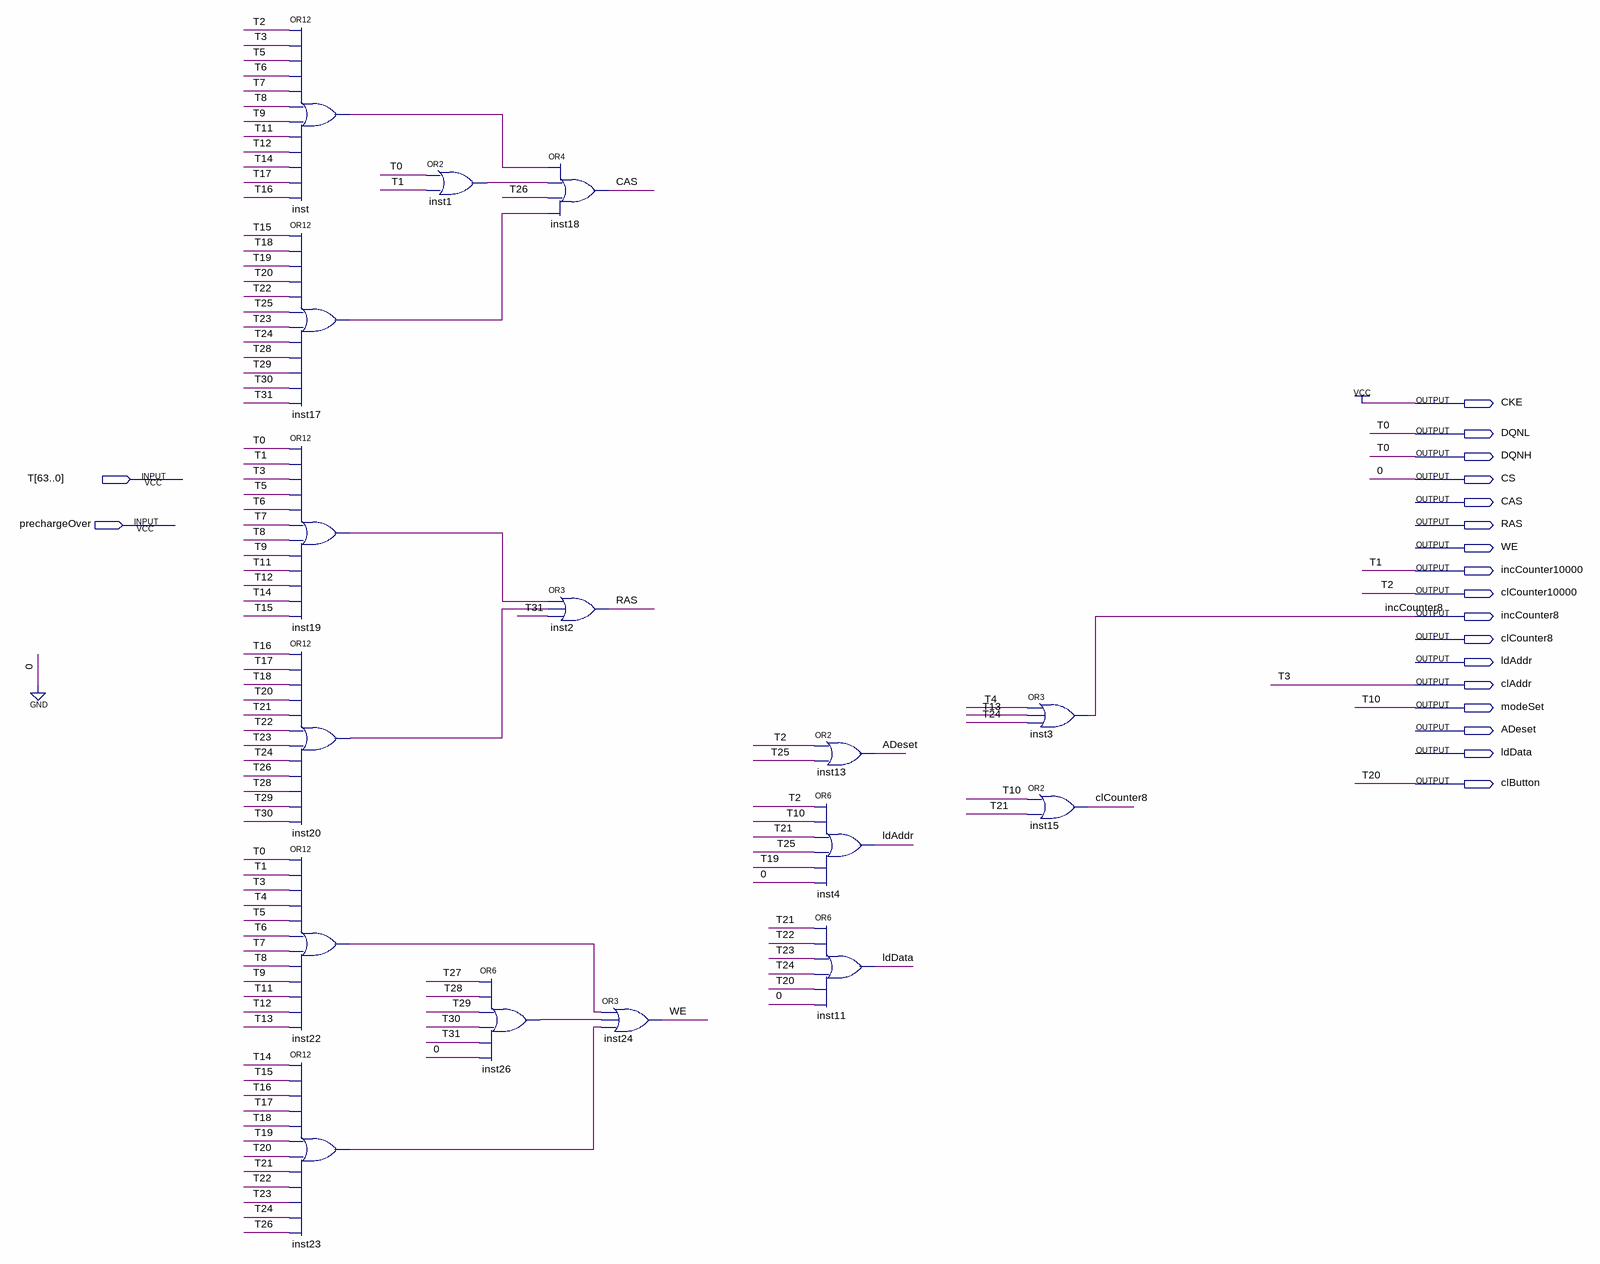
[diagram p0: schematic sheet]
// Quartus schematic OperacioniSignali.bdf as structural Verilog: 16 symbols, 19 pins
module OperacioniSignali (
  input  [63:0] T,
  input  prechargeOver,
  output CKE,
  output DQNL,
  output DQNH,
  output CS,
  output CAS,
  output RAS,
  output WE,
  output incCounter10000,
  output clCounter10000,
  output incCounter8,
  output clCounter8,
  output ldAddr,
  output clAddr,
  output modeSet,
  output ADeset,
  output ldData,
  output clButton
);

  wire inst1_out, inst17_out, inst19_out, inst20_out, inst22_out, inst23_out, inst26_out, inst_out;

  or inst (inst_out, T[2], T[3], T[5], T[6], T[7], T[8], T[9], T[11], T[12], T[14], T[17], T[16]);
  or inst17 (inst17_out, T[15], T[18], T[19], T[20], T[22], T[25], T[23], T[24], T[28], T[29], T[30], T[31]);
  or inst19 (inst19_out, T[0], T[1], T[3], T[5], T[6], T[7], T[8], T[9], T[11], T[12], T[14], T[15]);
  or inst20 (inst20_out, T[16], T[17], T[18], T[20], T[21], T[22], T[23], T[24], T[26], T[28], T[29], T[30]);
  or inst22 (inst22_out, T[0], T[1], T[3], T[4], T[5], T[6], T[7], T[8], T[9], T[11], T[12], T[13]);
  or inst23 (inst23_out, T[14], T[15], T[16], T[17], T[18], T[19], T[20], T[21], T[22], T[23], T[24], T[26]);
  or inst1 (inst1_out, T[0], T[1]);
  or inst26 (inst26_out, T[27], T[28], T[29], T[30], T[31], 1'b0);
  or inst18 (CAS, inst_out, inst1_out, T[26], inst17_out);
  or inst2 (RAS, inst19_out, inst20_out, T[31]);
  or inst24 (WE, inst22_out, inst26_out, inst23_out);
  or inst13 (ADeset, T[2], T[25]);
  or inst4 (ldAddr, T[2], T[10], T[21], T[25], T[19], 1'b0);
  or inst11 (ldData, T[21], T[22], T[23], T[24], T[20], 1'b0);
  or inst3 (incCounter8, T[4], T[13], T[24]);
  or inst15 (clCounter8, T[10], T[21]);

  assign CKE = 1'b1;
  assign clAddr = T[3];
  assign clButton = T[20];
  assign clCounter10000 = T[2];
  assign CS = 1'b0;
  assign DQNH = T[0];
  assign DQNL = T[0];
  assign incCounter10000 = T[1];
  assign modeSet = T[10];
endmodule
